# EAGLE design stereo-pwm (EAGLE 5.04)
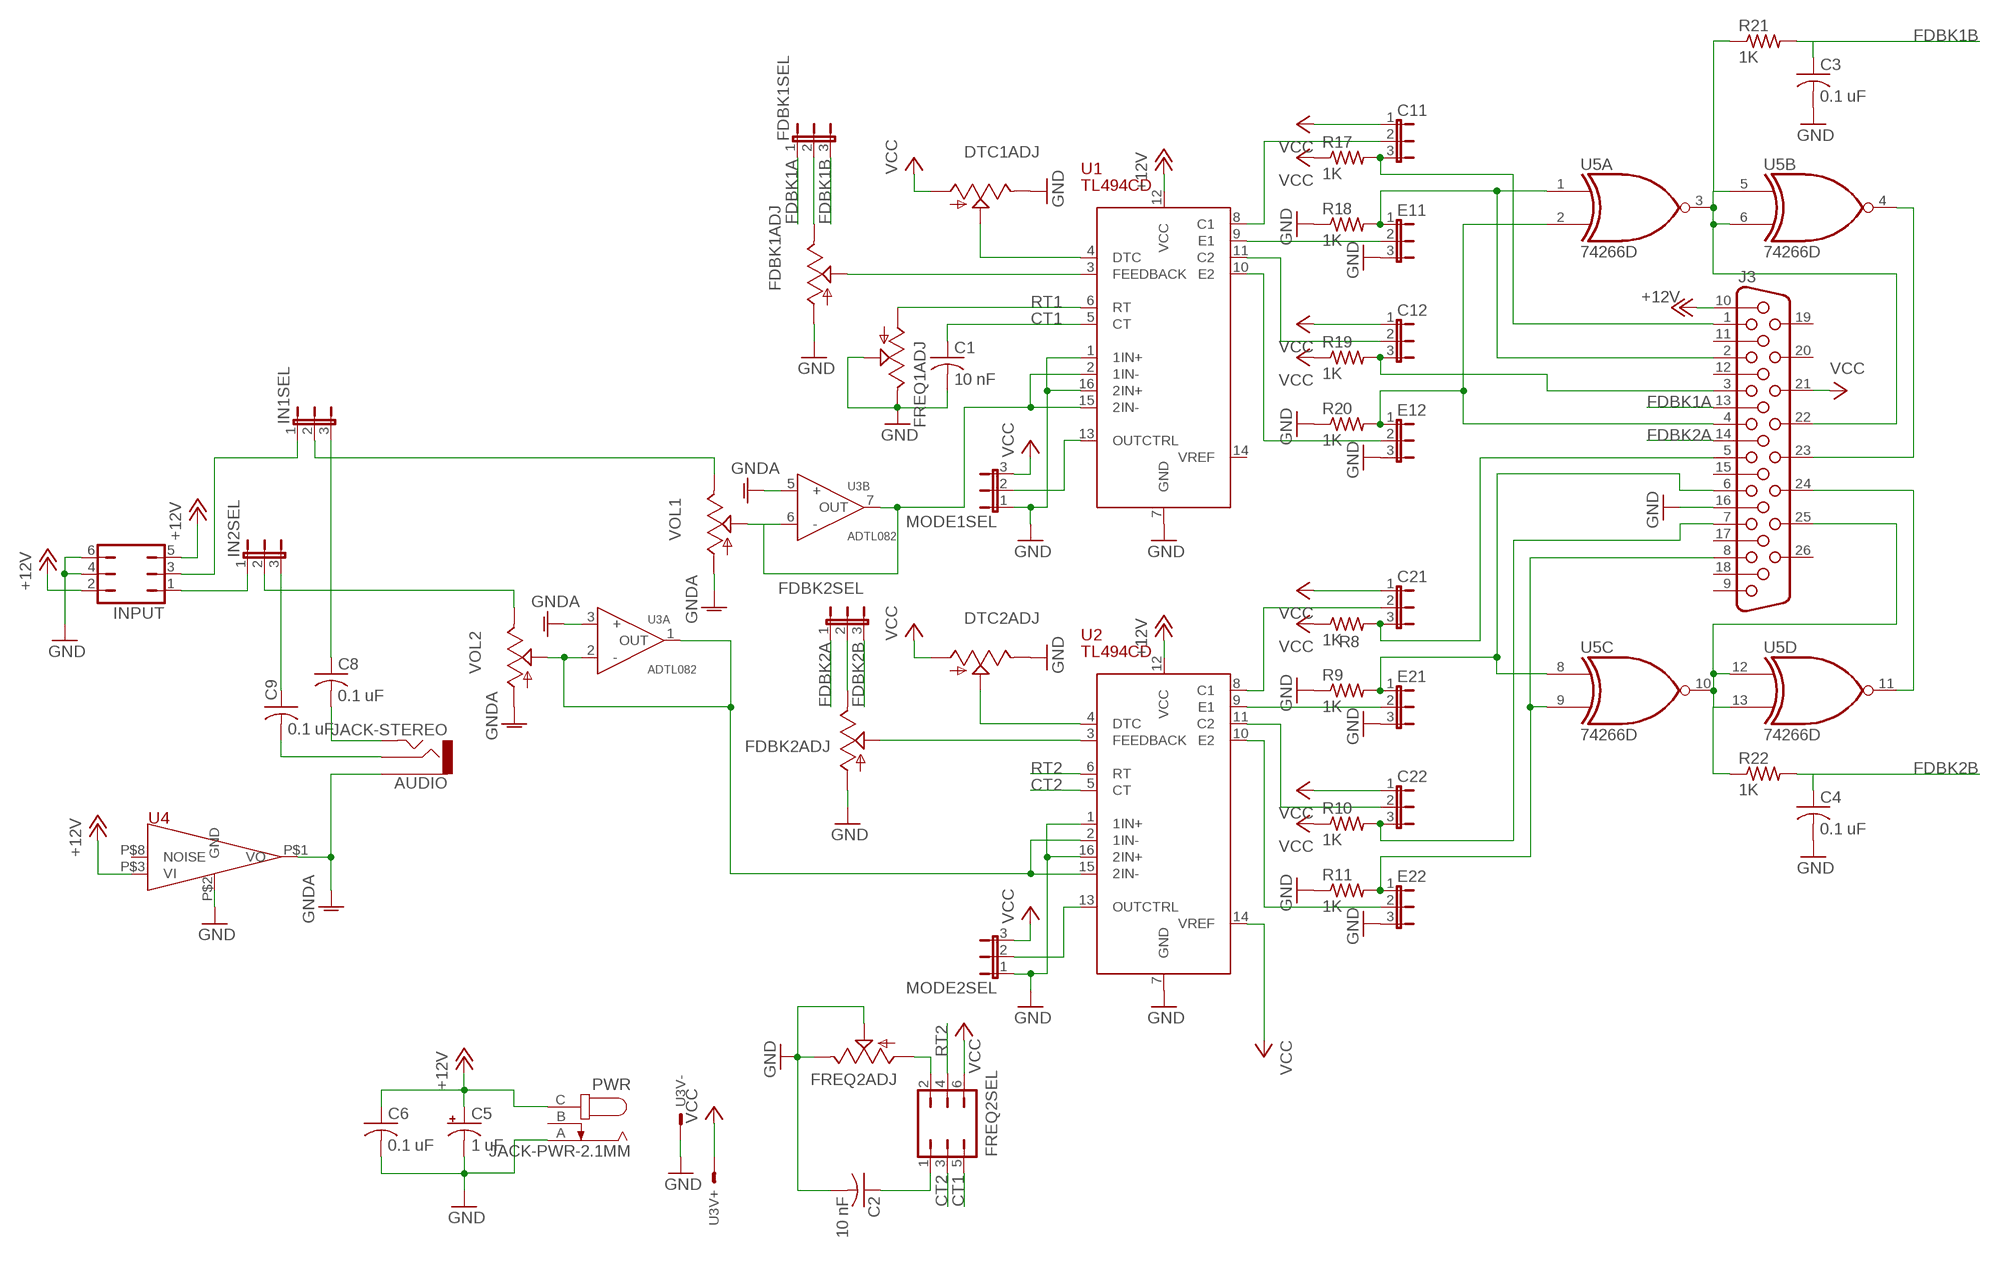
[diagram p0: schematic, sheet 1]

## Parts
AUDIO  JACK-STEREO  [AUDIO-JACK]
C1  10 nF  C-USC0603  [C0603]
C2  10 nF  C-USC0603  [C0603]
C3  0.1 uF  C-USC1206  [C1206]
C4  0.1 uF  C-USC1206  [C1206]
C5  1 uF  CPOL-US153CLV-0405  [153CLV-0405]
C6  0.1 uF  C-USC1206  [C1206]
C8  0.1 uF  C-USC1206  [C1206]
C9  0.1 uF  C-USC1206  [C1206]
C11  JP2E  [JP2]
C12  JP2E  [JP2]
C21  JP2E  [JP2]
C22  JP2E  [JP2]
DTC1ADJ  TRIM_US-CT6  [CT6]
DTC2ADJ  TRIM_US-CT6  [CT6]
E11  JP2E  [JP2]
E12  JP2E  [JP2]
E21  JP2E  [JP2]
E22  JP2E  [JP2]
FDBK1ADJ  TRIM_US-CT6  [CT6]
FDBK1SEL  JP2E  [JP2]
FDBK2ADJ  TRIM_US-CT6  [CT6]
FDBK2SEL  JP2E  [JP2]
FREQ1ADJ  TRIM_US-CT6  [CT6]
FREQ2ADJ  TRIM_US-CT6  [CT6]
FREQ2SEL  JP3Q  [JP3Q]
IN1SEL  JP2E  [JP2]
IN2SEL  JP2E  [JP2]
INPUT  JP3Q  [JP3Q]
J3  HF26V  [HDF26V]
MODE1SEL  JP2E  [JP2]
MODE2SEL  JP2E  [JP2]
PWR  JACK-PWR-2.1MM  [2.1MM-JACK-PLUG]
R8  1K  R-US_R0603  [R0603]
R9  1K  R-US_R0603  [R0603]
R10  1K  R-US_R0603  [R0603]
R11  1K  R-US_R0603  [R0603]
R17  1K  R-US_R0603  [R0603]
R18  1K  R-US_R0603  [R0603]
R19  1K  R-US_R0603  [R0603]
R20  1K  R-US_R0603  [R0603]
R21  1K  R-US_R0603  [R0603]
R22  1K  R-US_R0603  [R0603]
U1  TL494CD  [SO16]
U2  TL494CD  [SO16]
U3  ADTL082  [SO8]
U4  TLE2426  [SOIC-8]
U5  74266D  [SO14]
VOL1  TRIM_US-CT6  [CT6]
VOL2  TRIM_US-CT6  [CT6]

## Nets
+12V: C5.+ C6.1 INPUT.2 INPUT.5 J3.10 PWR.C U1.12(VCC) U2.12(VCC) U4.P$3(VI)
C21: C21.3 J3.5 R8.2
CT1: C1.1 FREQ2SEL.5 U1.5(CT)
CT2: FREQ2SEL.3 U2.5(CT)
FDBK1A: FDBK1SEL.1 J3.13
FDBK1B: C3.1 FDBK1SEL.3 R21.2
FDBK2A: FDBK2SEL.1 J3.14
FDBK2B: C4.1 FDBK2SEL.3 R22.2
GND: C1.2 C2.2 C3.2 C4.2 C5.- C6.2 DTC1ADJ.E DTC2ADJ.E E11.3 E12.3 E21.3 E22.3 FDBK1ADJ.A FDBK2ADJ.A FREQ1ADJ.E FREQ1ADJ.S FREQ2ADJ.E FREQ2ADJ.S INPUT.4 INPUT.6 J3.16 MODE1SEL.1 MODE2SEL.1 PWR.A R9.1 R11.1 R18.1 R20.1 U1.1(1IN+) U1.7(GND) U1.16(2IN+) U2.1(1IN+) U2.7(GND) U2.16(2IN+) U3.4(V-:S) U4.P$2(GND)
GNDA: AUDIO.1 U3.3(A:+) U3.5(B:+) U4.P$1(VO) VOL1.A VOL2.A
N$1: MODE2SEL.2 U2.13(OUTCTRL)
N$2: FREQ2ADJ.A FREQ2SEL.2
N$3: MODE1SEL.2 U1.13(OUTCTRL)
N$4: IN2SEL.2 VOL2.E
N$5: C21.2 U2.8(C1)
N$6: E21.2 U2.9(E1)
N$7: E22.2 U2.10(E2)
N$8: AUDIO.3 C8.2
N$9: C22.2 U2.11(C2)
N$10: C2.1 FREQ2SEL.1
N$12: AUDIO.2 C9.2
N$14: E21.1 J3.6 R9.2 U5.8(C:I0)
N$15: C22.3 J3.7 R10.2
N$16: E22.1 J3.8 R11.2 U5.9(C:I1)
N$17: DTC1ADJ.S U1.4(DTC)
N$18: IN1SEL.2 VOL1.E
N$19: C8.1 IN1SEL.3
N$20: FDBK2ADJ.E FDBK2SEL.2
N$21: DTC2ADJ.S
N$22: FDBK2ADJ.S U2.3(FEEDBACK)
N$23: C9.1 IN2SEL.3
N$24: C11.2 U1.8(C1)
N$25: IN2SEL.1 INPUT.1
N$26: IN1SEL.1 INPUT.3
N$27: E11.2
N$28: FDBK1ADJ.E FDBK1SEL.2
N$29: FDBK1ADJ.S U1.3(FEEDBACK)
N$31: U2.2(1IN-) U2.15(2IN-) U3.1(A:OUT) U3.2(A:-) VOL2.S
N$32: E12.2 U1.10(E2)
N$33: C12.2 U1.11(C2)
N$36: C11.3 J3.1 R17.2
N$37: E11.1 J3.2 R18.2 U5.1(A:I0)
N$38: C12.3 J3.3 R19.2
N$39: E12.1 J3.4 R20.2 U5.2(A:I1)
N$40: J3.22 R21.1 U5.3(A:O) U5.5(B:I0) U5.6(B:I1)
N$41: J3.24 U5.11(D:O)
N$42: J3.25 R22.1 U5.10(C:O) U5.12(D:I0) U5.13(D:I1)
N$43: U1.2(1IN-) U1.15(2IN-) U3.6(B:-) U3.7(B:OUT) VOL1.S
N$45: J3.23 U5.4(B:O)
RT1: FREQ1ADJ.A U1.6(RT)
RT2: FREQ2SEL.4 U2.6(RT)
VCC: C11.1 C12.1 C21.1 C22.1 DTC1ADJ.A DTC2ADJ.A FREQ2SEL.6 J3.21 MODE1SEL.3 MODE2SEL.3 R8.1 R10.1 R17.1 R19.1 U2.14(VREF) U3.8(V+:S)
Unconnected: J3.9 J3.11 J3.12 J3.15 J3.17 J3.18 J3.19 J3.20 J3.26 PWR.B U1.9(E1) U1.14(VREF) U2.4(DTC) U4.P$8(NOISE)

## Power pins joined to a net without a drawn wire
GND: U5.7(P:GND)
VCC: U5.14(P:VCC)

## Library data of the parts
AUDIO = logos-faves:JACK-STEREO
C1-C4 C6 C8 C9 = resistor:C-US: CAPACITOR, American symbol
C5 = resistor:CPOL-US: POLARIZED CAPACITOR, American symbol
C11 C12 C21 C22 E11 E12 E21 E22 FDBK1SEL FDBK2SEL IN1SEL IN2SEL MODE1SEL MODE2SEL = jumper:JP2E: JUMPER
DTC1ADJ DTC2ADJ FDBK1ADJ FDBK2ADJ FREQ1ADJ FREQ2ADJ VOL1 VOL2 = pot:TRIM_US-: POTENTIOMETER
FREQ2SEL INPUT = jumper:JP3Q: JUMPER
J3 = con-subd:HF26: SUB-D
PWR = logos-faves:JACK-PWR-2.1MM
R8-R11 R17-R22 = resistor:R-US_: RESISTOR, American symbol
U1 U2 = logos-faves:TL494CD
U3 = logos-faves:ADTL082: dual op-amp
U4 = logos-faves:TLE2426
U5 = 74xx-us:74*266: Quadruple EXCLUSIVE-NOR (XNOR), open-collector

## Board
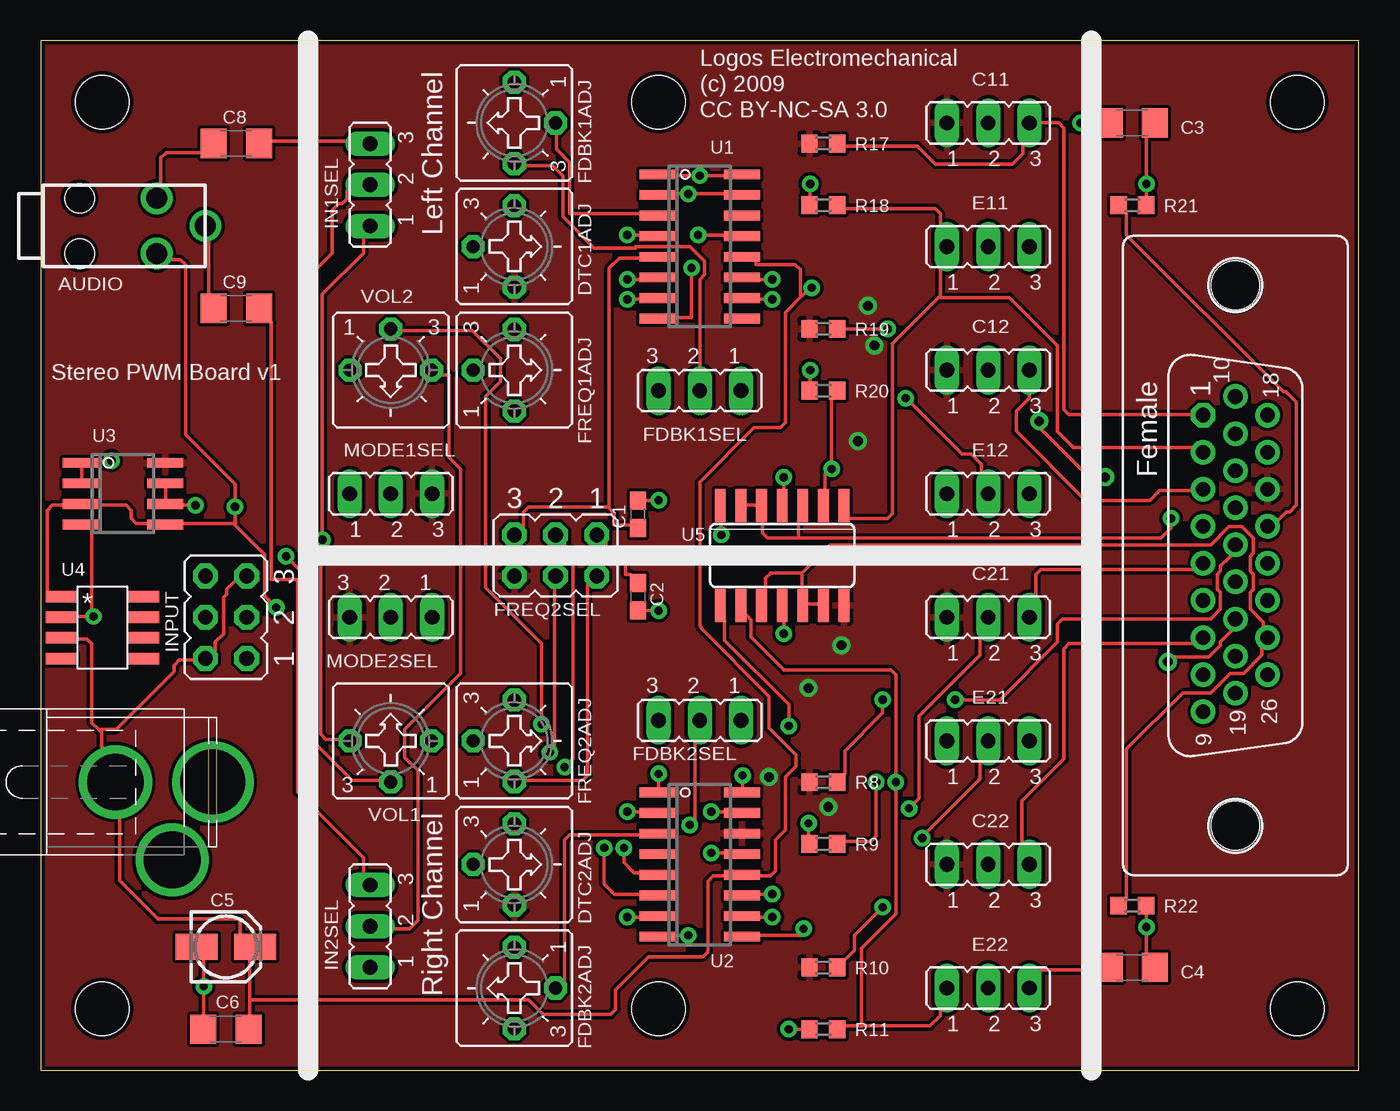
[diagram p1: board, top side]
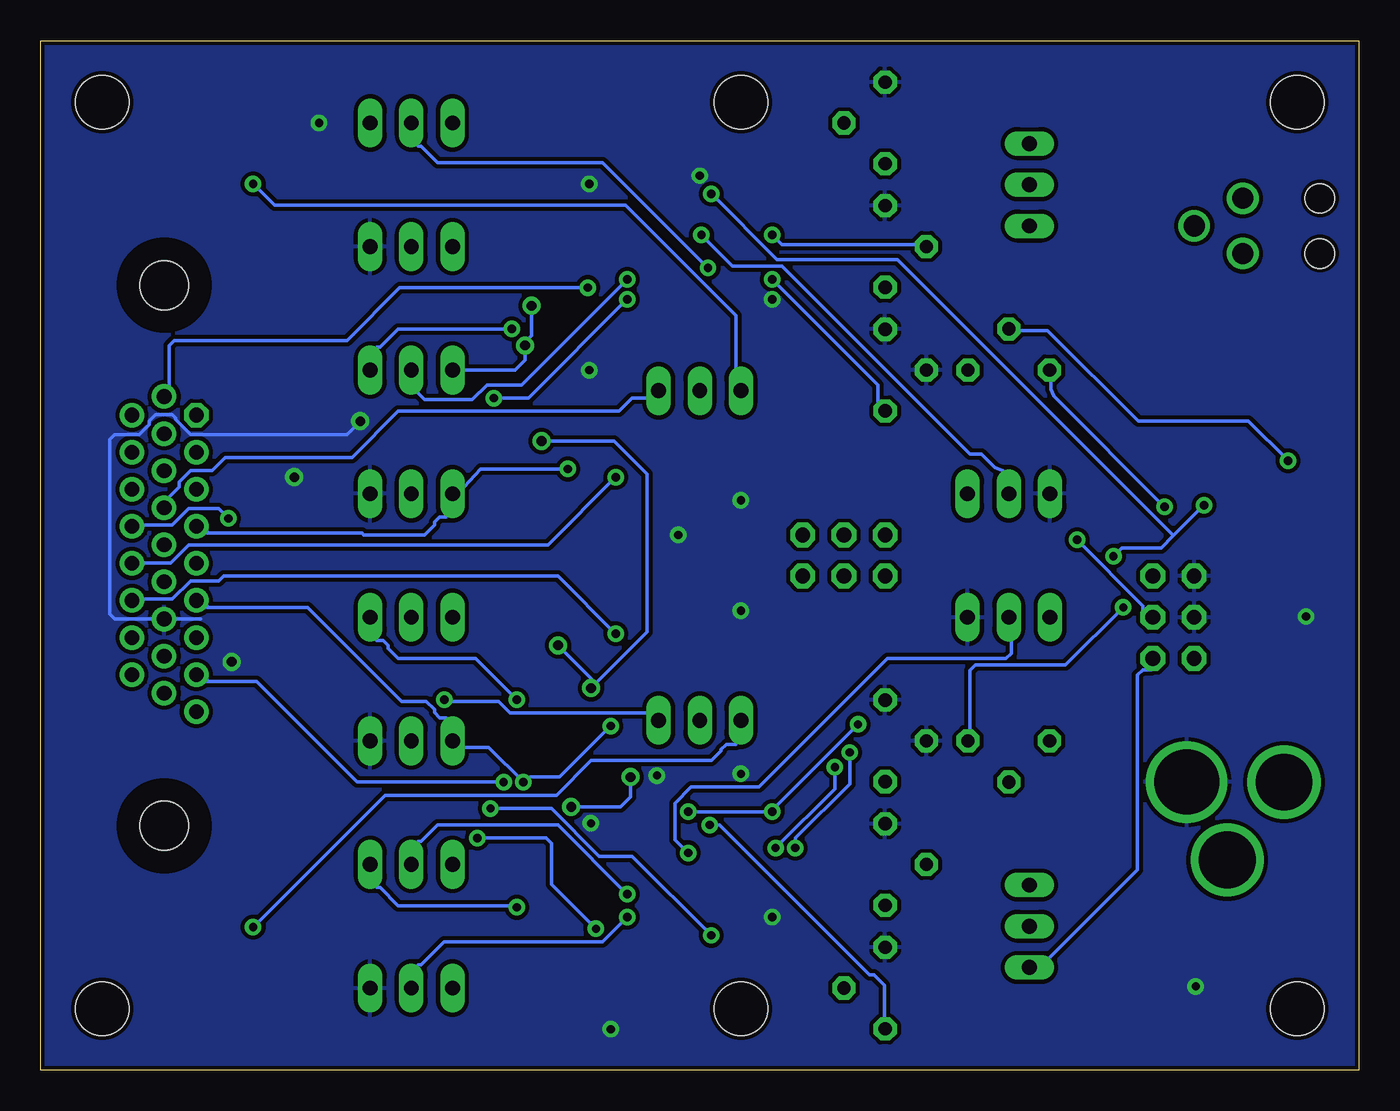
[diagram p2: board, bottom side, seen from below]

Size 81.28 x 63.5 mm. Coordinates in mm from the lower left corner, seen from the top.
Outline: 0,0 81.28,0 81.28,63.5 0,63.5 0,0
Copper layers (1*16): Top 0.035mm / dielectric 1.5mm / Bottom 0.035mm
Design rules "SparkFun": minimum track width 8mil, minimum drill 20mil, track to track 8mil, track to pad 8mil, pad to pad 8mil, via to via 8mil, smd to smd 8mil, copper to edge 10mil, drill to drill 8mil, minimum pad ring 12mil, minimum via ring 10mil, stop-mask expansion 4mil, vias tented up to drill 25mil, thermal gap 10mil

### Footprints (pad centres in the part's own frame; a part is rotated, then mirrored left to right if it is on the bottom)
AUDIO-JACK = drill 1.3 round: 1 3,1.7; 2 0,0; 3 3,-1.7 | hole 1.8: 7.75,1.7; 7.75,-1.7
C0603 = smd 1.1 x 1: 1 -0.85,0; 2 0.85,0
C1206 = smd 1.6 x 1.8: 1 -1.4,0; 2 1.4,0
153CLV-0405 = smd 2.6 x 1.6: + 1.8,0; - -1.8,0
JP2 = drill 0.914 long: 1 -2.54,0; 2 0,0; 3 2.54,0
CT6 = drill 0.813 octagon: A 2.515,0; E -2.515,0; S 0,-2.54
JP3Q = drill 0.914 octagon: 1 -2.54,-1.27; 2 -2.54,1.27; 3 0,-1.27; 4 0,1.27; 5 2.54,-1.27; 6 2.54,1.27
HDF26V = drill 0.9 octagon: 1 8.658,1.98 | drill 0.9 round: 2 6.372,1.98; 3 4.086,1.98; 4 1.8,1.98; 5 -0.486,1.98; 6 -2.772,1.98; 7 -5.058,1.98; 8 -7.344,1.98; 9 -9.63,1.98; 10 9.801,0; 11 7.515,0; 12 5.229,0; 13 2.943,0; 14 0.657,0; 15 -1.629,0; 16 -3.915,0; 17 -6.201,0; 18 -8.487,0; 19 8.658,-1.98; 20 6.372,-1.98; 21 4.086,-1.98; 22 1.8,-1.98; 23 -0.486,-1.98; 24 -2.772,-1.98; 25 -5.058,-1.98; 26 -7.344,-1.98 | hole 3: -16.65,0; 16.65,0
2.1MM-JACK-PLUG = drill 4 round: A 3,0 | drill 3.5 round: B 0.5,-4.8; C -3,0
R0603 = smd 1 x 1.1: 1 -0.85,0; 2 0.85,0
SO16 = smd 0.6 x 2.2: 1 -4.445,-2.6; 2 -3.175,-2.6; 3 -1.905,-2.6; 4 -0.635,-2.6; 5 0.635,-2.6; 6 1.905,-2.6; 7 3.175,-2.6; 8 4.445,-2.6; 9 4.445,2.6; 10 3.175,2.6; 11 1.905,2.6; 12 0.635,2.6; 13 -0.635,2.6; 14 -1.905,2.6; 15 -3.175,2.6; 16 -4.445,2.6
SO8 = smd 0.6 x 2.2: 1 -1.905,-2.6; 2 -0.635,-2.6; 3 0.635,-2.6; 4 1.905,-2.6; 5 1.905,2.6; 6 0.635,2.6; 7 -0.635,2.6; 8 -1.905,2.6
SOIC-8 = smd 1.905 x 0.711: P$1 -2.54,0; P$2 -2.54,-1.27; P$3 -2.54,-2.54; P$4 -2.54,-3.81; P$5 2.54,0; P$6 2.54,-1.27; P$7 2.54,-2.54; P$8 2.54,-3.81
SO14 = smd 0.66 x 2.032: 1 -3.81,-3.073; 2 -2.54,-3.073; 3 -1.27,-3.073; 4 0,-3.073; 5 1.27,-3.073; 6 2.54,-3.073; 7 3.81,-3.073; 8 3.81,3.073; 9 2.54,3.073; 10 1.27,3.073; 11 0,3.073; 12 -1.27,3.073; 13 -2.54,3.073; 14 -3.81,3.073
STAND-OFF = hole 3.302: 0,0

### Placement (x,y rotation side)
AUDIO  10.16,52.07 180 top
C1  36.83,34.29 90 top
C2  36.83,29.21 270 top
C3  67.31,58.42 180 top
C4  67.31,6.35 180 top
C5  11.43,7.62 0 top
C6  11.43,2.54 180 top
C8  12.06,57.15 180 top
C9  12.06,46.99 180 top
C11  58.42,58.42 0 top
C12  58.42,43.18 0 top
C21  58.42,27.94 0 top
C22  58.42,12.7 0 top
DTC1ADJ  29.21,50.8 270 top
DTC2ADJ  29.21,12.7 270 top
E11  58.42,50.8 0 top
E12  58.42,35.56 0 top
E21  58.42,20.32 0 top
E22  58.42,5.08 0 top
FDBK1ADJ  29.21,58.42 90 top
FDBK1SEL  40.64,41.91 180 top
FDBK2ADJ  29.21,5.08 90 top
FDBK2SEL  40.64,21.59 180 top
FREQ1ADJ  29.21,43.18 270 top
FREQ2ADJ  29.21,20.32 270 top
FREQ2SEL  31.75,31.75 180 top
IN1SEL  20.32,54.61 90 top
IN2SEL  20.32,8.89 90 top
INPUT  11.43,27.94 90 top
J3  73.66,31.75 90 top
MODE1SEL  21.59,35.56 0 top
MODE2SEL  21.59,27.94 180 top
PWR  7.62,17.78 0 top
R8  48.26,17.78 0 top
R9  48.26,13.97 0 top
R10  48.26,6.35 0 top
R11  48.26,2.54 0 top
R17  48.26,57.15 0 top
R18  48.26,53.34 0 top
R19  48.26,45.72 0 top
R20  48.26,41.91 0 top
R21  67.31,53.34 0 top
R22  67.31,10.16 0 top
U1  40.64,50.8 270 top
U2  40.64,12.7 270 top
U3  5.08,35.56 270 top
U4  3.81,29.21 0 top
U5  45.72,31.75 180 top
U$1  [STAND-OFF]  3.81,59.69 0 top
U$2  [STAND-OFF]  3.81,3.81 0 top
U$3  [STAND-OFF]  77.47,3.81 0 top
U$4  [STAND-OFF]  77.47,59.69 0 top
U$5  [STAND-OFF]  38.1,59.69 0 top
U$6  [STAND-OFF]  38.1,3.81 0 top
VOL1  21.59,20.32 0 top
VOL2  21.59,43.18 180 top

### Tracks (layer width: path | path; a pad name or v marks a point on that pad's centre or on a via)
+12V  (via drill 0.51)
  Top 0.203: 12.9,4.37 12.9,6.91 C5.+ 12.29,8.33 12.29,9.35 7.21,9.35 4.88,11.68 4.88,15.54 PWR.C 3.76,20.02 3.76,20.83 3.61,20.98 | 12.9,4.37 12.9,3.35 C6.1 | INPUT.5 11.99,30.18 11.48,29.67 11.48,29.36 11.28,29.16 11.28,26.92 10.77,26.42 10.77,25.81 INPUT.2 9.45,25.3 8.55,25.3 8.23,24.98 8.23,24.59 4.67,21.03 3.73,21.03 3.61,20.98 | 43.81,12.02 U2.12 42.16,11.99 41.47,11.99 41.15,11.67 41.15,7.33 40.83,7.01 37.49,7.01 35.46,4.98 35.46,3.77 35.14,3.45 30.99,3.45 30.07,4.37 12.9,4.37 | 43.81,12.02 44.3,11.99 | U1.12 44.09,49.89 44.09,49.68 46.52,49.68 46.84,49.37 46.84,47.75 46.89,47.7 | 46.89,47.7 45.92,46.74 45.92,39.94 45.61,39.62 43.99,39.62 40.64,36.27 40.64,27.46 40.73,27.24 44.91,23.06 44.91,21.13 46.58,19.46 46.58,18.75 45.92,18.09 45.92,14.83 45.31,14.22 45.31,12.31 45,11.99 44.3,11.99 | 46.89,47.7 47.14,47.95 v47.55,48.26 | 3.61,20.98 3.15,21.44 3.15,26.3 2.83,26.62 2.13,26.62 U4.P$3 | 43.81,12.02 43.81,12.06 43.89,11.99 44.3,11.99
  Bottom 0.203: v47.55,48.26 59.13,48.26 62.38,45.01 73.04,45.01 73.36,44.69 73.36,42.27 J3.10
C21  (via drill 0.51)
  Top 0.203: J3.5 71.02,30.89 61.68,30.89 61.37,30.57 61.37,29.36 C21.3 | v51.92,22.86 51.92,22.05 49.58,19.71 49.58,18.29 R8.2
  Bottom 0.203: v51.92,22.86 54.46,25.4 59.23,25.4 59.84,26.01 59.84,26.2 60.16,26.52 60.55,26.52 C21.3
CT1
  Top 0.203: 35,34.7 34.95,34.75 30.09,34.75 29.77,34.43 29.77,33.53 FREQ2SEL.5 | 35,34.7 35.36,34.34 35.36,33.63 36.37,33.63 C1.1 | U1.5 36.98,50.09 35.69,50.09 35.05,49.45 35.05,34.75 35,34.7
CT2  (via drill 0.51)
  Top 0.203: v35.97,13.72 35.97,12.83 36.6,12.19 36.98,12.19 U2.5 | v32.31,18.69 32.82,19.2 32.82,32.11 32.31,32.11 32.31,32.51 FREQ2SEL.3
  Bottom 0.203: v35.97,13.72 32.31,17.37 v32.31,18.69
FDBK1A
  Bottom 0.203: J3.13 73.36,35.36 72.75,35.97 72.75,36.27 72.03,36.98 70.71,36.98 69.9,37.8 62.08,37.8 59.23,40.64 45.62,40.64 44.81,41.45 43.89,41.45 FDBK1SEL.1
FDBK1B  (via drill 0.51)
  Top 0.203: R21.2 68.17,53.85 v68.17,54.66 68.17,58.01 C3.1
  Bottom 0.203: v68.17,54.66 66.85,53.34 45.21,53.34 38.41,46.53 38.41,43.38 FDBK1SEL.3
FDBK2A  (via drill 0.51)
  Top 0.203: v56.39,22.86 59.13,22.86 62.69,26.42 62.69,27.52 63.01,27.84 72.14,27.84 72.75,28.45 72.75,29.46 72.54,29.67 72.54,30.58 72.75,30.79 72.75,31.09 73.36,31.7 J3.14
  Bottom 0.203: v56.39,22.86 56.29,22.76 53.03,22.76 52.32,22.05 43.89,22.05 FDBK2SEL.1
FDBK2B  (via drill 0.51)
  Top 0.203: C4.1 68.17,6.81 v68.17,8.84 68.17,9.65 R22.2
  Bottom 0.203: v68.17,8.84 60.05,16.97 49.48,16.97 47.35,19.1 39.93,19.1 39.32,19.71 39.32,19.8 39,20.12 38.41,20.12 FDBK2SEL.3
GND  (via drill 0.51, 0.6)
  Top 0.203: C6.2 10.06,3.35 v10.06,5.18 10.06,6.91 C5.- | U1.1 39.12,55.17 v40.64,55.17 42.16,55.17 U1.16 | v38.1,28.35 37.29,28.35 C2.2 | v38.1,35.15 37.29,35.15 C1.2 | R11.1 v46.13,2.54 | v47.35,15.24 47.35,14.02 R9.1 | v47.45,43.18 47.45,42.37 R20.1 | v47.45,54.66 47.45,53.85 R18.1 | C4.2 65.94,6.2 61.67,6.2 E22.3 | C3.2 v64.11,58.42 | U4.P$2 2.45,27.99 v3.26,27.99 3.15,28.08 3.15,33.43 U3.4 | v41.96,33.02 41.96,33.83 U5.7 | v36.17,9.45 36.98,9.45 U2.7 | v38.1,18.29 38.1,17.37 U2.1 | v43.28,18.19 43.28,17.37 U2.16 | v36.17,47.55 36.98,47.55 U1.7 | J3.16 73.66,27.33 72.75,26.42 72.75,26.21 72.03,25.5 69.8,25.5 v69.49,25.2 | v61.57,40.03 61.57,39.62 64.62,36.58 v65.63,36.58
  Bottom 0.203: 71.95,27.84 71.83,27.84 71.53,27.84 71.41,27.84 73.35,27.84 73.36,27.84 76.69,27.84 77.01,28.16 77.01,38.9 76.69,39.22 75.18,39.22 74.57,39.83 74.57,40.03 74.17,40.44 73.15,40.44 72.95,40.23 72.95,40.13 72.03,39.22 62.38,39.22 v61.57,40.03
  pour Bottom (isolate 0.254): 0,63.5 81.28,63.5 81.28,0 0,0
GNDA  (via drill 0.51)
  Top 0.203: U4.P$1 0.41,29.2 0.41,34.53 0.72,34.85 1.42,34.85 U3.3 3.56,34.85 5.27,34.85 5.59,34.53 5.59,34.05 5.91,33.73 6.6,33.73 U3.5 8.74,33.73 11.89,33.73 11.94,33.68 | v14.53,28.55 13.82,29.26 13.82,31.8 11.94,33.68 | 11.94,33.68 11.99,33.73 v11.99,34.75 11.99,36.17 8.94,39.22 8.94,49.67 8.62,49.99 8.13,49.99 AUDIO.1
  Bottom 0.203: v14.53,28.55 18.09,24.99 23.66,24.99 23.98,24.68 23.98,20.93 VOL1.A | v11.99,34.75 18.81,41.57 19,42.02 19,42.57 VOL2.A
N$1  (via drill 0.51)
  Top 0.203: v41.35,13.41 42.16,13.41 U2.13
  Bottom 0.203: v41.35,13.41 42.16,14.22 42.16,16.48 41.16,17.48 36.98,17.48 29.06,25.4 21.75,25.4 21.44,25.72 21.44,26.52 MODE2SEL.2
N$2
  Top 0.203: FREQ2ADJ.A 29.87,17.88 33.41,17.88 33.73,18.2 33.73,29.97 FREQ2SEL.2
N$3  (via drill 0.51)
  Top 0.203: v40.54,51.51 42.16,51.51 U1.13
  Bottom 0.203: v40.54,51.51 38.61,49.58 35.56,49.58 23.98,38 23.27,38 22.44,37.17 21.99,36.98 21.95,36.98 MODE1SEL.2
N$4
  Top 0.203: VOL2.E 24.79,42.88 25.2,42.88 25.2,37.8 25.91,37.08 25.91,24.49 22.45,21.03 22.45,19.3 23.27,18.49 23.27,9.25 22.76,8.74 21.74,8.74 IN2SEL.2
N$5  (via drill 0.51)
  Top 0.203: v39.93,8.33 39.12,8.33 U2.8 | v53.54,16.15 54.15,16.76 54.15,21.84 57.91,25.6 57.91,26.62 C21.2
  Bottom 0.203: v39.93,8.33 44.81,13.21 46.84,13.21 49.78,16.15 v53.54,16.15
N$6  (via drill 0.51)
  Top 0.203: v47.04,8.74 47.04,8.33 44.3,8.33 U2.9 | v54.36,14.33 54.46,14.43 54.46,14.53 57.91,17.98 57.91,19 E21.2
  Bottom 0.203: v47.04,8.74 49.78,11.48 49.78,14.01 50.1,14.33 v54.36,14.33
N$7  (via drill 0.51)
  Top 0.203: v45.11,9.45 44.3,9.45 U2.10
  Bottom 0.203: v45.11,9.45 46.63,7.92 56.39,7.92 57.81,6.5 58.01,6.5 E22.2
N$8
  Top 0.203: C8.2 9.96,56.59 7.73,56.59 7.42,56.27 7.42,54.66 AUDIO.3
N$9  (via drill 0.51)
  Top 0.203: v45.11,10.87 44.3,10.87 U2.11
  Bottom 0.203: v45.11,10.87 49.38,15.14 56.79,15.14 57.81,14.12 58.01,14.12 C22.2
N$10
  Top 0.203: C2.1 36.37,30.58 36.07,30.58 36.07,31.5 35.56,32 34.85,32 34.85,32.51 FREQ2SEL.1
N$12
  Top 0.203: C9.2 10.36,47.85 10.36,51.1 AUDIO.2
N$14  (via drill 0.51)
  Top 0.203: v51.51,17.78 51.51,14.44 51.19,14.12 49.58,14.12 R9.2 | v46.13,21.23 46.13,22.55 42.16,26.52 42.16,27.74 U5.8
  Bottom 0.203: v46.13,21.23 49.28,18.09 51.1,18.09 v51.51,17.78 53.65,19.91 55.17,19.91 E21.1 56.29,21.74 56.68,21.74 57,22.06 57,22.25 57.51,22.76 59.03,22.76 64.82,28.55 71.02,28.55 71.02,28.65 J3.6
N$15  (via drill 0.51)
  Top 0.203: v51.92,10.06 50.19,8.33 50.19,7.42 49.58,6.81 R10.2 | J3.7 71.02,26.31 63.41,26.31 63.09,26 63.09,19.2 60.5,16.61 60.5,13.26 60.96,12.8 C22.3 60.55,14.12
  Bottom 0.203: v51.92,10.06 52.02,10.16 59.23,10.16 60.35,11.28 60.55,11.28 C22.3
N$16  (via drill 0.51)
  Top 0.203: 50.6,2.74 49.58,2.74 R11.2 | 50.6,2.74 54.84,2.74 55.47,3.38 55.47,3.66 E22.1 | 50.6,2.74 50.6,7.52 52.73,9.65 v52.73,17.78 52.73,24.37 52.41,24.69 45.82,24.69 43.79,26.72 43.79,27.76 43.62,27.99 43.4,28.14 U5.9
  Bottom 0.203: v52.73,17.78 61.77,17.78 67.97,23.98 71.02,23.98 71.02,24.08 J3.8
N$17  (via drill 0.51)
  Top 0.203: v36.17,51.51 36.98,51.51 U1.4
  Bottom 0.203: v36.17,51.51 35.56,50.9 27.33,50.9 DTC1ADJ.S
N$18
  Top 0.203: VOL1.E 18.39,20.42 17.59,20.42 17.27,20.74 17.27,31.6 16.56,32.31 16.56,48.97 17.98,50.39 17.98,53.03 18.39,53.44 18.58,53.44 18.9,53.76 18.9,54.25 IN1SEL.2
N$19
  Top 0.203: C8.1 14.22,57.3 18.9,57.3 IN1SEL.3
N$20  (via drill 0.51)
  Top 0.203: v40.03,15.14 40.34,15.44 40.34,20.12 FDBK2SEL.2
  Bottom 0.203: v40.03,15.14 39.42,15.14 30.18,5.89 29.9,5.89 29.26,5.26 29.26,3.25 FDBK2ADJ.E
N$22
  Top 0.203: U2.3 36.98,14.53 32.63,14.53 32.31,14.21 32.31,5.49 FDBK2ADJ.S
N$23
  Top 0.203: C9.1 14.22,46.13 14.22,30.28 15.85,30.28 15.85,17.17 19.91,13.11 19.91,12.09 IN2SEL.3
N$24  (via drill 0.51)
  Top 0.203: v40.13,49.48 40.13,46.43 39.12,46.43 U1.8
  Bottom 0.203: v40.13,49.48 46.63,55.98 56.79,55.98 57.81,57 58.01,57 C11.2
N$25
  Bottom 0.203: IN2SEL.1 19.72,6.5 19.72,6.39 19.68,6.35 13.65,12.38 13.65,24.37 13.34,24.69 12.8,24.69 INPUT.1
N$26  (via drill 0.51)
  Top 0.203: v17.37,32.72 17.37,47.85 19.91,50.39 19.91,51.41 IN1SEL.1
  Bottom 0.203: v17.37,32.72 13.31,28.65 13.31,28.35 INPUT.3
N$28
  Top 0.203: FDBK1ADJ.E 29.87,55.78 31.57,55.78 32.21,55.14 32.21,52.63 34.14,50.7 36.68,50.7 36.68,50.8 40.03,50.8 40.95,49.89 40.95,49.07 40.64,48.77 FDBK1SEL.2
N$29
  Top 0.203: U1.3 36.98,52.83 32.61,52.83 32.61,55.98 31.8,56.79 31.8,57.81 FDBK1ADJ.S
N$31  (via drill 0.51)
  Top 0.203: v36.17,15.95 36.98,15.95 U2.2 | v41.35,15.95 42.16,15.95 U2.15 | U3.2 2.54,36.47 2.54,37.19 U3.1 3.56,37.59 v4.37,37.59 | v30.89,21.34 30.89,26.31 27.43,29.77 27.43,41.55 28.35,42.47 28.35,43.89 26.62,45.62 22.25,45.62 VOL2.S
  Bottom 0.203: v41.35,15.95 v36.17,15.95 35.87,16.36 v30.89,21.34 | v4.37,37.59 6.81,40.03 13.61,40.03 19.2,45.62 20.93,45.62 VOL2.S
N$32  (via drill 0.51)
  Top 0.203: v45.11,47.55 44.3,47.55 U1.10 | v53.34,41.45 56.79,38 57.38,38 58.01,37.36 58.01,36.98 E12.2
  Bottom 0.203: v45.11,47.55 51.21,41.45 v53.34,41.45
N$33  (via drill 0.51)
  Top 0.203: v45.11,48.77 44.3,48.77 U1.11
  Bottom 0.203: v45.11,48.77 51.61,42.27 53.75,42.27 54.66,41.35 57.61,41.35 58.01,41.76 C12.2
N$36
  Top 0.203: R17.2 49.58,57 54.05,57 55.17,55.88 59.92,55.88 60.55,56.52 60.55,57 C11.3 62.78,58.42 63.09,58.1 63.09,40.75 63.41,40.44 71.02,40.44 J3.1
N$37
  Top 0.203: R18.2 49.58,53.14 55.16,53.14 55.47,52.82 55.47,52.22 E11.1 55.47,49.38 55.47,47.75 55.42,47.7 | 55.42,47.7 52.53,44.81 52.53,34.35 52.21,34.04 49.78,34.04 U5.1 | J3.2 71.02,38.41 63.69,38.41 62.69,39.41 62.69,44.7 59.74,47.65 55.47,47.65 55.42,47.7
N$38  (via drill 0.51)
  Top 0.203: R19.2 v52.22,45.72 | C12.3 60.96,41.45 60.15,40.64 60.15,39.42 64.41,35.15 68.38,35.15 68.99,35.76 71.53,35.76 71.6,35.84 J3.3
  Bottom 0.203: v52.22,45.72 59.23,45.72 60.35,44.6 60.55,44.6 C12.3
N$39  (via drill 0.51)
  Top 0.203: 48.72,37.13 48.36,36.78 48.36,35.76 U5.2 | 48.72,37.13 48.77,37.19 48.77,41.45 R20.2 | 48.72,37.13 v48.77,37.08
  Bottom 0.203: J3.4 71.02,33.22 71.02,33.12 61.47,33.12 61.37,33.02 57.61,33.02 57,33.63 57,33.82 56.68,34.14 56.29,34.14 E12.1 55.17,35.97 54.15,37.08 v48.77,37.08
N$40  (via drill 0.51)
  Top 0.203: U5.6 43.48,34.85 44.2,34.85 U5.5 44.5,33.83 44.5,33.13 44.82,32.82 46.63,32.82 46.69,32.87 | 46.69,32.87 46.74,32.92 46.74,33.83 U5.3 | R21.1 66.95,52.83 66.95,51.51 76.61,41.86 76.78,41.86 77.42,41.22 77.42,34.85 77.01,34.44 76.81,34.44 76.3,33.93 J3.22 | v69.7,34.04 69.7,33.45 69.06,32.82 46.74,32.82 46.69,32.87
  Bottom 0.203: v69.7,34.04 70.31,34.65 72.14,34.65 73.15,33.63 74.98,33.63 J3.22
N$41  (via drill 0.51)
  Top 0.203: v45.82,26.92 45.82,27.74 U5.11
  Bottom 0.203: v45.82,26.92 49.38,30.48 70,30.48 70.31,30.18 72.03,30.18 73.15,29.06 74.98,29.06 J3.24
N$42
  Top 0.203: 46.94,30.68 45.02,30.68 44.7,30.37 44.7,29.67 U5.10 | 46.94,30.68 46.94,29.67 U5.12 47.24,28.75 47.95,28.75 U5.13 | R22.1 66.95,10.67 66.95,19.81 70.41,23.27 72.14,23.27 73.36,24.49 74.17,24.49 75.29,25.6 75.29,26.01 J3.25 75.39,27.43 75.39,27.64 74.57,28.45 74.57,29.46 74.78,29.67 74.78,30.58 74.57,30.79 74.57,31.7 74.78,31.9 74.78,32.82 74.07,33.53 73.25,33.53 72.14,32.41 48.67,32.41 46.94,30.68
N$43  (via drill 0.51)
  Top 0.203: U1.2 39.12,54.05 v39.93,54.05 42.16,54.05 U1.15 | U3.7 7.72,35.97 7.72,35.15 U3.6 8.74,34.85 v9.55,34.85 | v15.14,31.7 16.87,29.97 16.87,20.22 19.2,17.88 20.93,17.88 VOL1.S
  Bottom 0.203: 11.43,32.97 12.19,32.21 14.63,32.21 v15.14,31.7 | 11.43,32.97 v9.55,34.85 | v39.93,54.05 35.87,49.99 28.45,49.99 11.43,32.97
N$45  (via drill 0.51)
  Top 0.203: v45.82,36.58 45.82,35.76 U5.4
  Bottom 0.203: v45.82,36.58 49.99,32.41 72.14,32.41 73.25,31.29 74.98,31.29 J3.23
RT1  (via drill 0.51)
  Top 0.203: v36.17,48.77 36.98,48.77 U1.6
  Bottom 0.203: v36.17,48.77 29.67,42.27 29.67,41.25 29.57,41.25 FREQ1ADJ.A
RT2  (via drill 0.51)
  Top 0.203: v34.75,13.72 34.75,11.51 35.38,10.87 36.98,10.87 U2.6 | v31.39,19.61 31.7,19.91 31.7,29.77 FREQ2SEL.4
  Bottom 0.203: v34.75,13.72 34.75,14.33 31.39,17.68 v31.39,19.61
VCC  (via drill 0.6)
  Bottom 0.203: v51,47.14 51,45.31 51.41,44.91 v51.41,44.7 51.41,43.79 52.02,43.18 55.78,43.18 55.88,43.08 C12.1 | v44.91,18.09 44.91,16.87 45.52,16.26 v48.56,16.26 | v49.38,26.21 47.35,24.18 v47.35,23.57 43.89,27.03 43.89,36.78 45.92,38.81 v50.39,38.81
  pour Top: 0,63.5 81.28,63.5 81.28,0 0,0

### Text on the board
tPlace: Logos Electromechanical | (c) 2009 | CC BY-NC-SA 3.0 | Stereo PWM Board v1
tNames: Left Channel | Right Channel